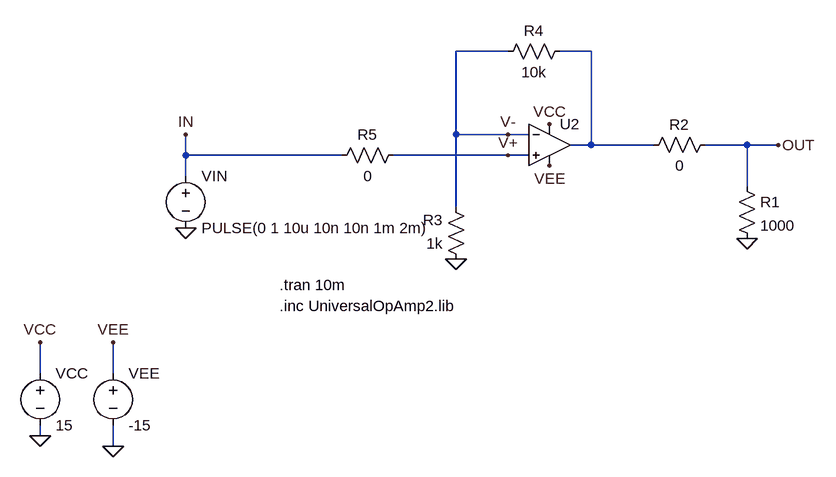
[diagram p0: schematic noninverting-opamp.asc]
noninverting-opamp.asc, the LTspice schematic file:
Version 4
SHEET 1 1360 680
WIRE 96 48 16 48
WIRE 224 48 176 48
WIRE 16 176 16 48
WIRE 96 176 16 176
WIRE 128 176 96 176
WIRE 224 192 224 48
WIRE 224 192 192 192
WIRE 320 192 224 192
WIRE 464 192 400 192
WIRE 512 192 464 192
WIRE -400 208 -400 176
WIRE -160 208 -400 208
WIRE 96 208 -80 208
WIRE 128 208 96 208
WIRE -400 240 -400 208
WIRE 464 256 464 192
WIRE 16 288 16 176
WIRE -624 544 -624 496
WIRE -512 544 -512 496
WIRE -624 640 -624 624
WIRE -512 656 -512 624
FLAG -624 640 0
FLAG -512 656 0
FLAG -400 320 0
FLAG 464 336 0
FLAG 512 192 OUT
FLAG -400 176 IN
FLAG 16 368 0
FLAG -512 496 VEE
FLAG -624 496 VCC
FLAG 160 224 VEE
FLAG 160 160 VCC
FLAG 96 176 V-
FLAG 96 208 V+
SYMBOL voltage -512 528 R0
SYMATTR InstName VEE
SYMATTR Value -15
SYMBOL voltage -624 528 R0
WINDOW 123 0 0 Left 0
WINDOW 39 0 0 Left 0
SYMATTR InstName VCC
SYMATTR Value 15
SYMBOL voltage -400 224 R0
WINDOW 123 0 0 Left 0
WINDOW 39 0 0 Left 0
SYMATTR InstName VIN
SYMATTR Value PULSE(0 1 10u 10n 10n 1m 2m)
SYMBOL res 448 240 R0
SYMATTR InstName R1
SYMATTR Value 1000
SYMBOL res 416 176 R90
WINDOW 0 0 56 VBottom 2
WINDOW 3 32 56 VTop 2
SYMATTR InstName R2
SYMATTR Value 0
SYMBOL OpAmps\\UniversalOpamp2 160 192 R0
SYMATTR InstName U2
SYMBOL res 32 384 R180
WINDOW 0 36 76 Left 2
WINDOW 3 36 40 Left 2
SYMATTR InstName R3
SYMATTR Value 1k
SYMBOL res 192 32 R90
WINDOW 0 0 56 VBottom 2
WINDOW 3 32 56 VTop 2
SYMATTR InstName R4
SYMATTR Value 10k
SYMBOL res -64 192 R90
WINDOW 0 0 56 VBottom 2
WINDOW 3 32 56 VTop 2
SYMATTR InstName R5
SYMATTR Value 0
TEXT -256 440 Left 2 !.inc UniversalOpAmp2.lib
TEXT -256 408 Left 2 !.tran 10m

The netlist it stands for:
* noninverting-opamp.asc
VEE VEE 0 -15
VCC VCC 0 15
VIN IN 0 PULSE(0 1 10u 10n 10n 1m 2m)
R1 OUT 0 1000
R2 OUT N001 0
XU2 V+ V- VCC VEE N001 level.2 Avol=1Meg GBW=10Meg Slew=10Meg ilimit=25m rail=0 Vos=0 phimargin=45 en=0 enk=0 in=0 ink=0 Rin=500Meg  ; pins IN+ IN- V+ V- OUT
R3 0 V- 1k
R4 N001 V- 10k
R5 V+ IN 0
.inc UniversalOpAmp2.lib
.tran 10m
.lib UniversalOpamps2.sub
.backanno
.end